# Altium project nanoboard.PrjPcb
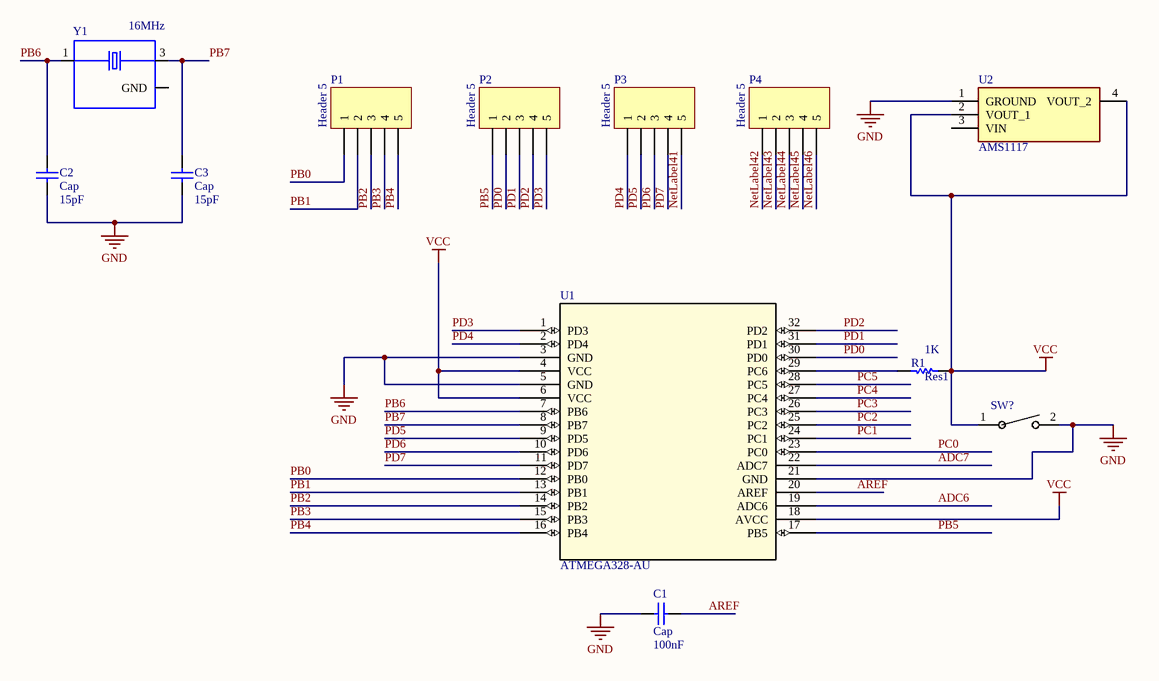
[diagram p0: nanoboard.SchDoc]
1 sheet, 12 parts. Net scope: global (net labels, ports and power ports of the same name join across sheets).
Board file: nanoboard.PcbDoc

## Sheet nanoboard.SchDoc
size B; SheetNumber: 1; SheetTotal: 1; SPICEModelCacheYRNIXUYK: <root> / <DocumentId>YRNIXUYK</DocumentId> / </root>

### Parts
C1  Cap  value 100nF  [6-0805_M]
C2  Cap  value 15pF  [0603]
C3  Cap  value 15pF  [0603]
P1  Header 5  [HDR1X5]
P2  Header 5  [HDR1X5]
P3  Header 5  [HDR1X5]
P4  Header 5  [HDR1X5]
R1  Res1  value 1K  [C1206]
SW?  (no value)  [SW_PTS636_CNK]
U1  ATMEGA328-AU  [QFP80P900X900X120-32N]
U2  AMS1117  [SOT229P700X180-4N]
Y1  16MHz  [OSCCC320X250X60N]

### Nets
GND: C1.1 C2.1 C3.1 SW?.2 U1.3(GND) U1.5(GND) U1.21(GND) U2.1(GROUND)
VCC: R1.1 SW?.1 U1.4(VCC) U1.6(VCC) U1.18(AVCC) U2.2(VOUT_1) U2.4(VOUT_2)
ADC6: U1.19(ADC6)
ADC7: U1.22(ADC7)
AREF: C1.2 U1.20(AREF)
NetLabel41: P3.5
NetLabel42: P4.1
NetLabel43: P4.2
NetLabel44: P4.3
NetLabel45: P4.4
NetLabel46: P4.5
PB0: P1.1 U1.12(PB0)
PB1: P1.2 U1.13(PB1)
PB2: P1.3 U1.14(PB2)
PB3: P1.4 U1.15(PB3)
PB4: P1.5 U1.16(PB4)
PB5: P2.1 U1.17(PB5)
PB6: C2.2 U1.7(PB6) Y1.1
PB7: C3.2 U1.8(PB7) Y1.3
PC0: U1.23(PC0)
PC1: U1.24(PC1)
PC2: U1.25(PC2)
PC3: U1.26(PC3)
PC4: U1.27(PC4)
PC5: U1.28(PC5)
PD0: P2.2 U1.30(PD0)
PD1: P2.3 U1.31(PD1)
PD2: P2.4 U1.32(PD2)
PD3: P2.5 U1.1(PD3)
PD4: P3.1 U1.2(PD4)
PD5: P3.2 U1.9(PD5)
PD6: P3.3 U1.10(PD6)
PD7: P3.4 U1.11(PD7)
NetR1_2: R1.2 U1.29(PC6)
NetY1_2: Y1.2(GND) Y1.4(GND)

Not connected (* = marked no-connect by the designer): U2 3(VIN)

### Library data of the parts
C1-C3 = Cap: Capacitor; Published: 8-Jun-2000; LatestRevisionDate: 17-Jul-2002; LatestRevisionNote: Re-released for DXP Platform.; PackageReference: RAD-0.3; Publisher: Altium Limited; PackageDescription: Radial Cap, Thru-Hole; 2 Leads; 0.3 in Pin Spacing
P1-P4 = Header 5: Header, 5-Pin; LatestRevisionDate: 17-Jul-2002; LatestRevisionNote: Re-released for DXP Platform.; Publisher: Altium Limited
R1 = Res1: Resistor; Published: 8-Jun-2000; LatestRevisionDate: 17-Jul-2002; LatestRevisionNote: Re-released for DXP Platform.; PackageReference: AXIAL-0.3; Publisher: Altium Limited; PackageDescription: Axial Device, Thru-Hole; 2 Leads; 0.3 in Pin Spacing
SW? = PTS636 SM50J SMTR LFS: No Description Available; Mfr_Name: C&K Components; Type: Tactile Switches
U1 = ATMEGA328-AU: No Description Available; Mfr_Name: Microchip; RefDes: RefDes; Type: Type
U2 = AMS1117: 1117; Manufacturer_Name: Advanced Monolithic Systems; Geometry.Height: 1.8mm; Manufacturer_Part_Number: AMS1117; Mouser Part Number: *; Mouser Price/Stock: *; Arrow Part Number: *; Arrow Price/Stock: *; Datasheet Link: https://datasheet.lcsc.com/szlcsc/Advanced-Monolithic-Systems-AMS-AMS1117-ADJ_C6188.pdf
Y1 = CX3225SB16000D0GZJC1: Crystal 25.0000mhz 8pf Smd; Package: None; Price: None; Value: *; MP: CX3225SB16000D0GZJC1; Availability: Unavailable